# Altium project XL_N76E003K3..PrjPCB
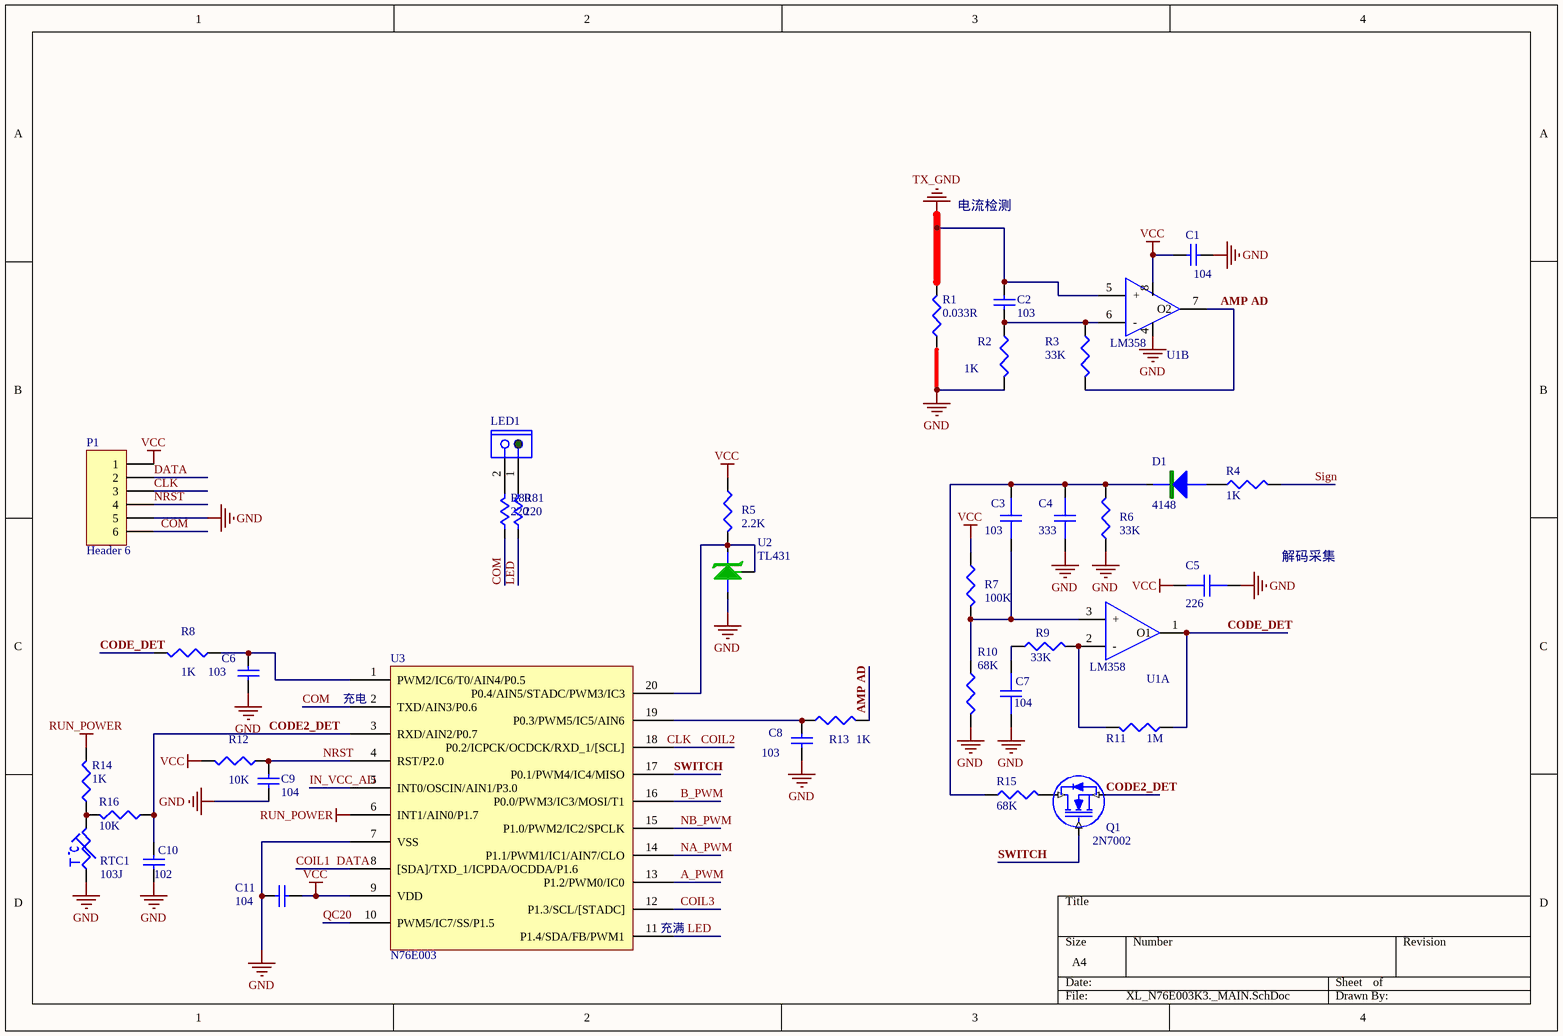
[diagram p0: XL_N76E003K3._MAIN.SchDoc]
2 sheets, 120 parts. Net scope: global (net labels, ports and power ports of the same name join across sheets).
Board file: 10W三线圈-XT.PcbDoc
Sheets:
  XL_N76E003K3._MAIN.SchDoc
  XL_N76E003K3._POWER_V17.SchDoc

## Sheet XL_N76E003K3._MAIN.SchDoc
size A4

### Parts
C1  104  [C0402]
C2  103  [C0402]
C3  103  [C0402]
C4  333  [C0402]
C5  226  [C0805]
C6  103  [C0402]
C7  104  [C0402]
C8  103  [C0402]
C9  104  [C0402]
C10  102  [C0402]
C11  104  [C0402]
D1  4148  [sod323]
LED1  (no value)  [PIN2_2.54]
P1  Header 6  [SPIN6]
Q1  2N7002  [SOT-23B]
R1  0.033R  [R0805]
R2  1K  [R0402]
R3  33K  [R0402]
R4  1K  [R0402]
R5  2.2K  [R0402]
R6  33K  [R0402]
R7  100K  [R0402]
R8  1K  [R0402]
R9  33K  [R0402]
R10  68K  [R0402]
R11  1M  [R0402]
R12  10K  [R0402]
R13  1K  [R0402]
R14  1K  [R0402]
R15  68K  [R0402]
R16  10K  [R0402]
R80  220  [R0402]
R81  220  [R0402]
RTC1  103J  [R0402]
U1  LM358  [SOP8]  (parts A,B of 2)
U2  TL431  [SOT-23-431]
U3  N76E003  [SOP20]

### Nets
GND: C1.1 C4.1 C5.1 C6.1 C7.1 C8.2 C9.2 C10.1 C11.1 P1.5 R1.1 R2.2 R6.1 R10.2 RTC1.1 U1.4 U2.1 U3.7(VSS)
RUN_POWER: R14.2 U3.6(INT1/AIN0/P1.7)
TX_GND: C2.1 R1.2 U1.5(+)
VCC: C1.2 C5.2 C11.2 P1.1 R5.1 R7.1 R12.2 U1.8 U3.9(VDD)  [project net 5V]
A_PWM: U3.13(P1.2/PWM0/IC0)
AMP AD: R3.2 R13.2 U1.7(O2)
B_PWM: U3.16(P0.0/PWM3/IC3/MOSI/T1)
CLK: P1.3
CODE2_DET: C10.2 Q1.E(S) R16.1 U3.3(RXD/AIN2/P0.7)
CODE_DET: R8.2 R11.1 U1.1(O1)
COIL1: P1.2 U3.8([SDA]/TXD_1/ICPDA/OCDDA/P1.6)  [also labelled DATA]
COIL2: U3.18(P0.2/ICPCK/OCDCK/RXD_1/[SCL])
COIL3: U3.12(P1.3/SCL/[STADC])
COM: P1.6 R80.1 U3.2(TXD/AIN3/P0.6)
IN_VCC_AD: U3.5(INT0/OSCIN/AIN1/P3.0)
LED: R81.1 U3.11(P1.4/SDA/FB/PWM1)
NA_PWM: U3.14(P1.1/PWM1/IC1/AIN7/CLO)
NB_PWM: U3.15(P1.0/PWM2/IC2/SPCLK)
NRST: C9.1 P1.4 R12.1 U3.4(RST/P2.0)
QC20: U3.10(PWM5/IC7/SS/P1.5)
Sign: R4.2
SWITCH: Q1.B(G) U3.17(P0.1/PWM4/IC4/MISO)
NetC2_2: C2.2 R2.1 R3.1 U1.6(-)
NetC3_1: C3.1 C4.2 D1.2 R6.2 R15.1
NetC3_2: C3.2 R7.2 R10.1 U1.3(+)
NetC6_2: C6.2 R8.1 U3.1(PWM2/IC6/T0/AIN4/P0.5)
NetC7_2: C7.2 R9.1
NetC8_1: C8.1 R13.1 U3.19(P0.3/PWM5/IC5/AIN6)
NetD1_1: D1.1 R4.1
NetLED1_1: LED1.1 R81.2
NetLED1_2: LED1.2 R80.2
NetQ1_C: Q1.C(D) R15.2
NetR5_2: R5.2 U2.2 U2.3 U3.20(P0.4/AIN5/STADC/PWM3/IC3)
NetR9_2: R9.2 R11.2 U1.2(-)
NetR14_1: R14.1 R16.2 RTC1.2

### Notes on the sheet
- 电流检测
- 解码采集
- (near U3) 充电
- (near U3) 充满
- Labels drawn without touching a wire or pin: CLK

### Library data of the parts
C1 C6 C8-C11 = Cap: Capacitor; Published: 8-Jun-2000; LatestRevisionDate: 17-Jul-2002; LatestRevisionNote: Re-released for DXP Platform.; Publisher: Altium Limited
  C1 C9: Value: 104
  C6 C8: Value: 103
  C10: Value: 102
C2 = Cap: Capacitor; Value: 104; Published: 8-Jun-2000; LatestRevisionDate: 17-Jul-2002; LatestRevisionNote: Re-released for DXP Platform.; Publisher: Altium Limited
C3-C5 C7 = CH
D1 = D0: 1N4001
LED1 = CON2
P1 = Header 6: Header, 6-Pin; LatestRevisionDate: 17-Jul-2002; LatestRevisionNote: Re-released for DXP Platform.; Publisher: Altium Limited
Q1 = MOSFETN
R1 R3 R5-R7 R9-R11 R15 R16 = R: 1K
R2 R4 R8 R12-R14 = R
R80 R81 = Res01
RTC1 = RTC
U1 = 4558
U2 = IC TL431: IC
U3 = 103F

## Sheet XL_N76E003K3._POWER_V17.SchDoc
size A4
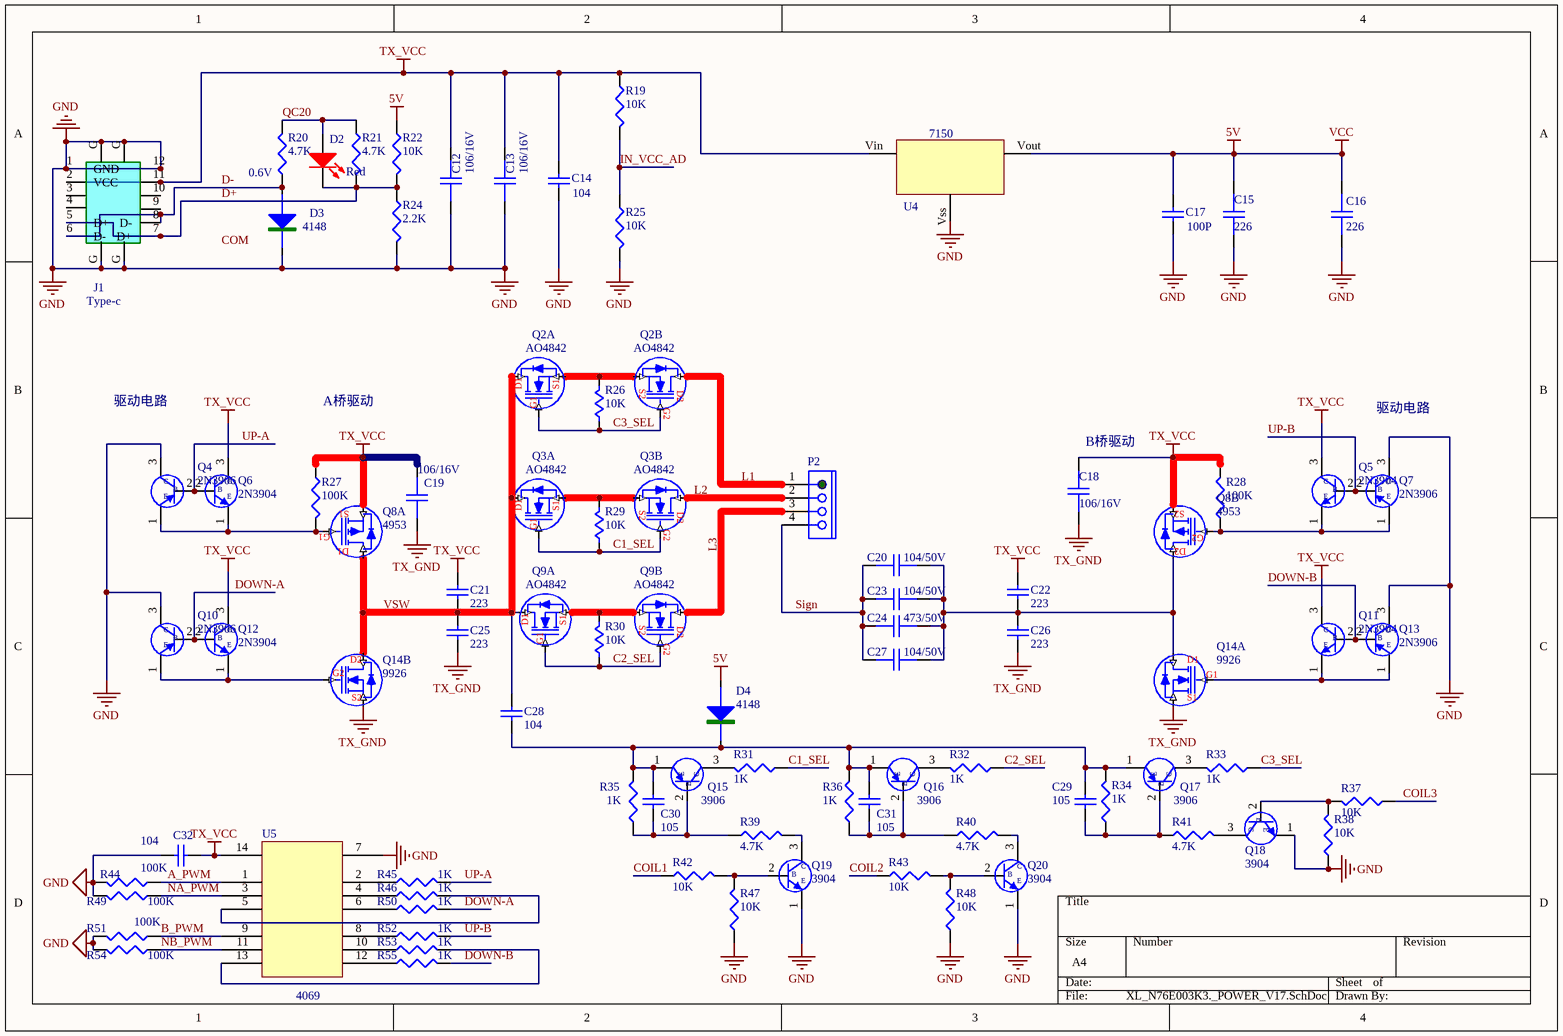
[diagram p1: XL_N76E003K3._POWER_V17.SchDoc]

### Parts
C12  106/16V  [C0805]
C13  106/16V  [C0805]
C14  104  [C0402]
C15  226  [C0805]
C16  226  [C0805]
C17  100P  [C0402]
C18  106/16V  [C0805]
C19  106/16V  [C0805]
C20  104/50V  [C1206]
C21  223  [C1206]
C22  223  [C1206]
C23  104/50V  [C1206]
C24  473/50V  [C1206]
C25  223  [C0402]
C26  223  [C1206]
C27  104/50V  [C1206]
C28  104  [C0402]
C29  105  [C0402]
C30  105  [C0402]
C31  105  [C0402]
C32  104  [C0402]
D2  Red  [LED0603]
D3  4148  [SOD323]
D4  4148  [SOD323]
J1  Type-c  [USB -MRO17]
P2  (no value)  [USB -MRO18-2]
Q2  AO4842  [SOP8D]  (parts A,B of 2)
Q3  AO4842  [SOP8D]  (parts A,B of 2)
Q4  2N3906  [SOT-23]
Q5  2N3904  [SOT-23]
Q6  2N3904  [SOT-23]
Q7  2N3906  [SOT-23]
Q8  4953  [SOP8D]  (parts A,B of 2)
Q9  AO4842  [SOP8D]  (parts A,B of 2)
Q10  2N3906  [SOT-23]
Q11  2N3904  [SOT-23]
Q12  2N3904  [SOT-23]
Q13  2N3906  [SOT-23]
Q14  9926  [SOP8D]  (parts A,B of 2)
Q15  3906  [SOT-23]
Q16  3906  [SOT-23]
Q17  3906  [SOT-23]
Q18  3904  [SOT-23]
Q19  3904  [SOT-23]
Q20  3904  [SOT-23]
R19  10K  [R0402]
R20  4.7K  [R0402]
R21  4.7K  [R0402]
R22  10K  [R0402]
R24  2.2K  [R0402]
R25  10K  [R0402]
R26  10K  [R0402]
R27  100K  [R0402]
R28  100K  [R0402]
R29  10K  [R0402]
R30  10K  [R0402]
R31  1K  [R0402]
R32  1K  [R0402]
R33  1K  [R0402]
R34  1K  [R0402]
R35  1K  [R0402]
R36  1K  [R0402]
R37  10K  [R0402]
R38  10K  [R0402]
R39  4.7K  [R0402]
R40  4.7K  [R0402]
R41  4.7K  [R0402]
R42  10K  [R0402]
R43  10K  [R0402]
R44  100K  [R0402]
R45  1K  [R0402]
R46  1K  [R0402]
R47  10K  [R0402]
R48  10K  [R0402]
R49  100K  [R0402]
R50  1K  [R0402]
R51  100K  [R0402]
R52  1K  [R0402]
R53  1K  [R0402]
R54  100K  [R0402]
R55  1K  [R0402]
U4  7150  [SOT-23-7150]
U5  4069  [SOP14]

### Nets
5V: C15.1 C16.2 C17.1 D4.1 R22.2 U4.Vout  [also labelled VCC]
GND: C12.2 C13.2 C14.2 C15.2 C16.1 C17.2 C32.1 D3.2 J1.1(GND) J1.12 J1.G Q4.3(C) Q7.3(C) Q10.3(C) Q13.3(C) Q18.1(E) Q19.1(E) Q20.1(E) R24.1 R25.1 R38.1 R44.2 R47.1 R48.1 R49.2 R51.2 R54.2 U4.Vss U5.7
TX_GND: C18.2 C19.2 C25.1 C26.1 Q14.E1(S1) Q14.E2(S2)
TX_VCC: C12.1 C13.1 C14.1 C18.1 C19.1 C21.2 C22.2 C32.2 J1.2(VCC) J1.11 Q5.3(C) Q6.3(C) Q8.E1(S1) Q8.E2(S2) Q11.3(C) Q12.3(C) R19.2 R27.1 R28.2 U4.Vin U5.14
A_PWM: R44.1 U5.1
B_PWM: R51.1 U5.9
C1_SEL: Q3.B1(G1) Q3.B2(G2) R29.1 R31.1
C2_SEL: Q9.B1(G1) Q9.B2(G2) R30.1 R32.1
C3_SEL: Q2.B1(G1) Q2.B2(G2) R26.1 R33.1
COIL1: R42.1
COIL2: R43.1
COIL3: R37.1
D+: D2.2(K) J1.5(D+) J1.7(D+) R21.1 R22.1 R24.2
D-: D3.1 J1.6(D-) J1.8(D-) R20.2
DOWN-A: Q10.2(B) Q12.2(B) R50.2
DOWN-B: Q11.2(B) Q13.2(B) R55.2
IN_VCC_AD: R19.1 R25.2
L1: P2.1 Q2.C2(D2)
L2: P2.2 Q3.C2(D2)
L3: P2.3 Q9.C2(D2)
NA_PWM: R49.1 U5.3
NB_PWM: R54.1 U5.11
QC20: D2.1(A) R20.1 R21.2
Sign: C20.1 C23.1 C24.1 C27.1 P2.4
UP-A: Q4.2(B) Q6.2(B) R45.2
UP-B: Q5.2(B) Q7.2(B) R52.2
VSW: C21.1 C25.2 C28.1 Q2.C1(D1) Q3.C1(D1) Q8.C1(D1) Q9.C1(D1) Q14.C2(D2)
NetC20_2: C20.2 C22.1 C23.2 C24.2 C26.2 C27.2 Q8.C2(D2) Q14.C1(D1)
NetC28_2: C28.2 C29.1 C30.1 C31.1 D4.2 Q15.1(E) Q16.1(E) Q17.1(E) R34.2 R35.2 R36.2
NetC29_2: C29.2 Q17.2(B) R34.1 R41.1
NetC30_2: C30.2 Q15.2(B) R35.1 R39.1
NetC31_2: C31.2 Q16.2(B) R36.1 R40.1
NetQ2_E1: Q2.E1(S1) Q2.E2(S2) R26.2
NetQ3_E1: Q3.E1(S1) Q3.E2(S2) R29.2
NetQ4_1: Q4.1(E) Q6.1(E) Q8.B1(G1) R27.2
NetQ5_1: Q5.1(E) Q7.1(E) Q8.B2(G2) R28.1
NetQ9_E1: Q9.E1(S1) Q9.E2(S2) R30.2
NetQ10_1: Q10.1(E) Q12.1(E) Q14.B2(G2)
NetQ11_1: Q11.1(E) Q13.1(E) Q14.B1(G1)
NetQ15_3: Q15.3(C) R31.2
NetQ16_3: Q16.3(C) R32.2
NetQ17_3: Q17.3(C) R33.2
NetQ18_2: Q18.2(B) R37.2 R38.2
NetQ18_3: Q18.3(C) R41.2
NetQ19_2: Q19.2(B) R42.2 R47.2
NetQ19_3: Q19.3(C) R39.2
NetQ20_2: Q20.2(B) R43.2 R48.2
NetQ20_3: Q20.3(C) R40.2
NetR45_1: R45.1 U5.2
NetR46_1: R46.1 U5.4
NetR46_2: R46.2 U5.5
NetR50_1: R50.1 U5.6
NetR52_1: R52.1 U5.8
NetR53_1: R53.1 U5.10
NetR53_2: R53.2 U5.13
NetR55_1: R55.1 U5.12

Not connected (* = marked no-connect by the designer): J1 3 4 9 10

### Notes on the sheet
- 0.6V
- 驱动电路
- A桥驱动
- (near C18) B桥驱动
- Labels drawn without touching a wire or pin: COM

### Library data of the parts
C12 C13 C15 C16 C18-C20 C23 C24 C27 = CH
C14 C28 C32 = Cap: Capacitor; Published: 8-Jun-2000; LatestRevisionDate: 17-Jul-2002; LatestRevisionNote: Re-released for DXP Platform.; Publisher: Altium Limited; Value: 104
C17 C21 C22 C25 C26 C29-C31 = Cap: Capacitor; Value: 104; Published: 8-Jun-2000; LatestRevisionDate: 17-Jul-2002; LatestRevisionNote: Re-released for DXP Platform.; Publisher: Altium Limited
D2 = LED02
D3 D4 = D0: 1N4001
J1 = USP12P
P2 = CON4
Q2 Q3 Q9 Q14 = MOSFETN2
Q4 Q7 Q10 Q13 Q15-Q17 = PNP01
Q5 Q6 Q11 Q12 Q18-Q20 = NPN01
Q8 = MOSFETP2
R19-R22 R24 R25 R27 R28 R37-R44 R47-R49 R51 R54 = R: 1K
R26 R29 R30 = Res01
R31-R36 R45 R46 R50 R52 R53 R55 = R
U4 = VOLTREG
U5 = CD4069

## Nets that join several sheets
5V: XL_N76E003K3._MAIN (9 pins), XL_N76E003K3._POWER_V17 (6 pins)
GND: XL_N76E003K3._MAIN (18 pins), XL_N76E003K3._POWER_V17 (29 pins)
TX_GND: XL_N76E003K3._MAIN (C2.1 R1.2 U1.5), XL_N76E003K3._POWER_V17 (6 pins)
A_PWM: XL_N76E003K3._MAIN (U3.13), XL_N76E003K3._POWER_V17 (R44.1 U5.1)
B_PWM: XL_N76E003K3._MAIN (U3.16), XL_N76E003K3._POWER_V17 (R51.1 U5.9)
COIL1: XL_N76E003K3._MAIN (P1.2 U3.8), XL_N76E003K3._POWER_V17 (R42.1)
COIL2: XL_N76E003K3._MAIN (U3.18), XL_N76E003K3._POWER_V17 (R43.1)
COIL3: XL_N76E003K3._MAIN (U3.12), XL_N76E003K3._POWER_V17 (R37.1)
IN_VCC_AD: XL_N76E003K3._MAIN (U3.5), XL_N76E003K3._POWER_V17 (R19.1 R25.2)
NA_PWM: XL_N76E003K3._MAIN (U3.14), XL_N76E003K3._POWER_V17 (R49.1 U5.3)
NB_PWM: XL_N76E003K3._MAIN (U3.15), XL_N76E003K3._POWER_V17 (R54.1 U5.11)
QC20: XL_N76E003K3._MAIN (U3.10), XL_N76E003K3._POWER_V17 (D2.1 R20.1 R21.2)
Sign: XL_N76E003K3._MAIN (R4.2), XL_N76E003K3._POWER_V17 (5 pins)